# EAGLE design Spectacle_Servo_Control_Board (EAGLE 7.6.0)
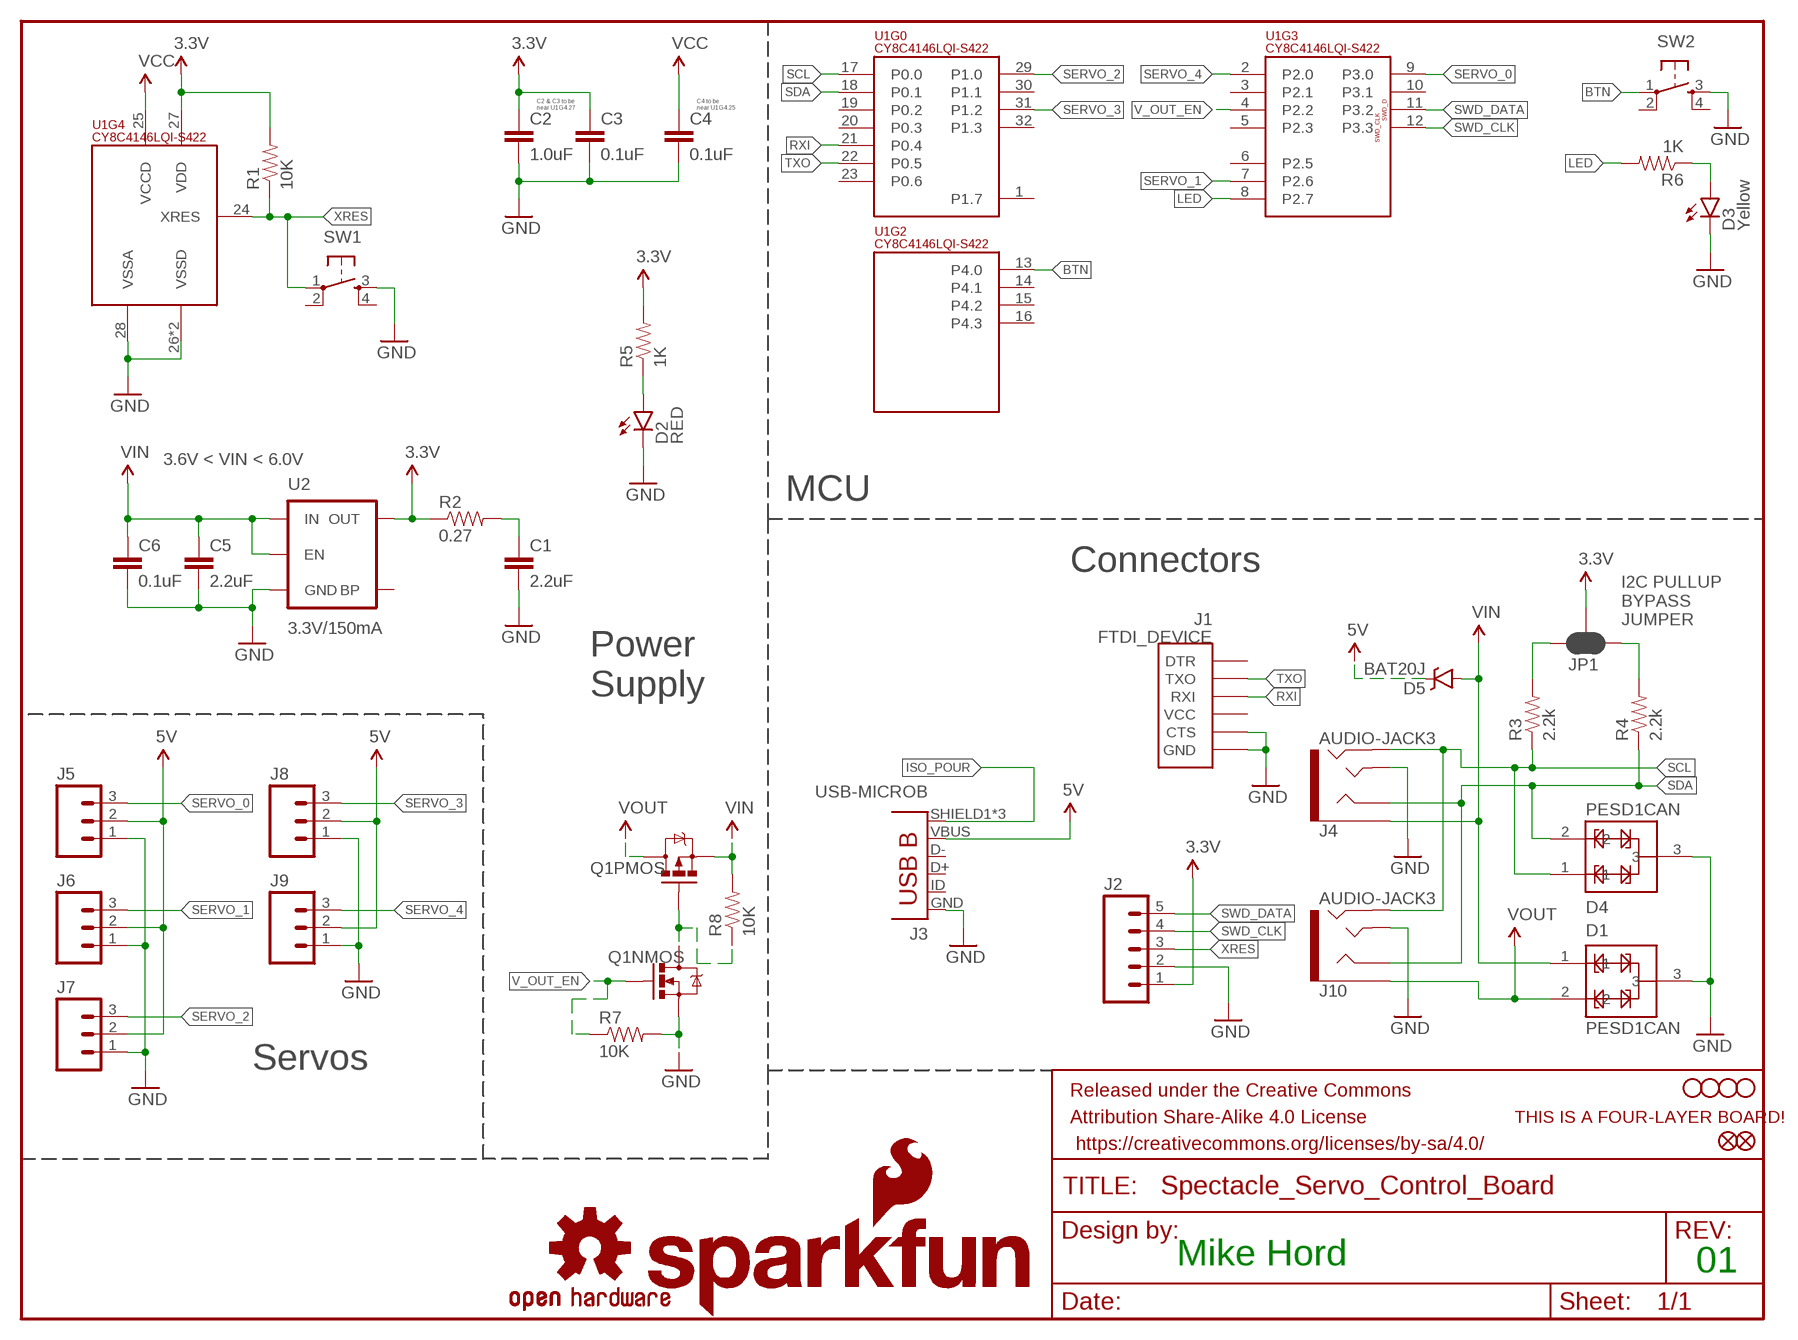
[diagram p0: schematic, sheet 1]

## Parts
C1  2.2uF  2.2UF-10V-20%(0603)  [0603-CAP]
C2  1.0uF  1.0UF-16V-10%(0402)  [0402-CAP]
C3  0.1uF  0.1UF-16V(+-10%)(0402)  [0402-CAP]
C4  0.1uF  0.1UF-16V(+-10%)(0402)  [0402-CAP]
C5  2.2uF  2.2UF-10V-20%(0603)  [0603-CAP]
C6  0.1uF  0.1UF-16V(+-10%)(0402)  [0402-CAP]
D1  PESD1CAN  [SOT23-3]
D2  RED  LED-RED0603  [LED-0603]
D3  Yellow  LED-YELLOW0603-SMART  [LED-0603]
D4  PESD1CAN  [SOT23-3]
D5  BAT20J  DIODE-SCHOTTKY-BAT20J  [SOD-323]
FD1  FIDUCIALUFIDUCIAL  [MICRO-FIDUCIAL]
FD2  FIDUCIALUFIDUCIAL  [MICRO-FIDUCIAL]
FRAME1  FRAME-LETTER  [CREATIVE_COMMONS]
H1  STAND-OFF  [STAND-OFF]
H2  STAND-OFF  [STAND-OFF]
H3  STAND-OFF  [STAND-OFF]
H4  STAND-OFF  [STAND-OFF]
J1  FTDI_DEVICE  [FTDI_DEVICE_SIDE]
J2  M05PTH  [1X05]
J3  USB-MICROB  USB-MICROB"  [USB-B-MICRO-SMD_V03]
J4  AUDIO-JACK3  [AUDIO-JACK-TRRS-SMD]
J5  M03LOCK  [1X03_LOCK]
J6  M03LOCK  [1X03_LOCK]
J7  M03LOCK  [1X03_LOCK]
J8  M03LOCK  [1X03_LOCK]
J9  M03LOCK  [1X03_LOCK]
J10  AUDIO-JACK3  [AUDIO-JACK-TRRS-SMD]
JP1  JUMPER-PAD-3-NC_BY_PASTE  [PAD-JUMPER-3-NC_BY_PASTE_YES_SILK_FULL_BOX]
LOGO1  OSHW-LOGOS  [OSHW-LOGO-S]
LOGO2  SFE_LOGO_NAME_FLAME.1_INCH  [SFE_LOGO_NAME_FLAME_.1]
LOGO3  SFE_LOGO_NAME_FLAME.1_INCH  [SFE_LOGO_NAME_FLAME_.1]
LOGO4  OSHW-LOGOS  [OSHW-LOGO-S]
Q1  IRF7509  [MSOP8]
R1  10K  10KOHM-1/10W-1%(0603)0603  [0603-RES]
R2  0.27  0.27OHM-1/10W-1%(0603)  [0603-RES]
R3  2.2k  2.2KOHM-1/10W-1%(0603)  [0603-RES]
R4  2.2k  2.2KOHM-1/10W-1%(0603)  [0603-RES]
R5  1K  1KOHM-1/10W-1%(0603)  [0603-RES]
R6  1K  1KOHM-1/10W-1%(0603)  [0603-RES]
R7  10K  10KOHM-1/10W-1%(0603)0603  [0603-RES]
R8  10K  10KOHM-1/10W-1%(0603)0603  [0603-RES]
SW1  SWITCH_SPST_4_PINRECT  [TACTILE_SWITCH_SMD_4.6X2.8MM]
SW2  SWITCH_SPST_4_PINRECT  [TACTILE_SWITCH_SMD_4.6X2.8MM]
U1  CY8C4146LQI-S422  PSOC4_4100S_32QFN  [QFN-32]
U2  3.3V/150mA  V_REG_MIC52053.3V  [SOT23-5]
U$1  FOUR_LAYER_WARNING  [FOUR_LAYER_WARNING]

## Nets
3.3V: C2.1 C3.1 J2.1 JP1.2 R1.2 R2.1 R5.2 U1.27(VDD) U2.5(OUT)
5V: D5.C J3.VBUS J5.2 J6.2 J7.2 J8.2 J9.2
BTN: SW2.1 U1.13(P4.0)
GND: C1.2 C2.2 C3.2 C4.2 C5.2 C6.2 D1.3 D2.C D3.C D4.3 J1.P$5(CTS) J1.P$6(GND) J2.2 J3.GND J4.TIP J5.1 J6.1 J7.1 J8.1 J9.1 J10.TIP Q1.1(NMOS:S) R7.2 SW1.3 SW2.3 U1.26(VSSD) U1.28(VSSA) U1.EP(VSSD) U2.2(GND)
ISO_POUR: J3.SHIELD1(SHIELD) J3.SHIELD2(SHIELD) J3.SHIELD3(SHIELD)
LED: R6.2 U1.8(P2.7)
N$2: JP1.3 R3.2
N$3: C1.1 R2.2
N$4: D2.A R5.1
N$5: D3.A R6.1
N$6: JP1.1 R4.2
N$26: Q1.4(PMOS:G) Q1.7(NMOS:D) Q1.8(NMOS:D) R8.1
RXI: J1.P$3(RXI) U1.21(P0.4)
SCL: D4.1 J4.RING2 J10.RING2 R3.1 U1.17(P0.0)
SDA: D4.2 J4.RING1 J10.RING1 R4.1 U1.18(P0.1)
SERVO_0: J5.3 U1.9(P3.0)
SERVO_1: J6.3 U1.7(P2.6)
SERVO_2: J7.3 U1.29(P1.0)
SERVO_3: J8.3 U1.31(P1.2)
SERVO_4: J9.3 U1.2(P2.0)
SWD_CLK: J2.4 U1.12(P3.3)
SWD_DATA: J2.5 U1.11(P3.2)
TXO: J1.P$2(TXO) U1.22(P0.5)
V_OUT_EN: Q1.2(NMOS:G) R7.1 U1.4(P2.2)
VCC: C4.1 U1.25(VCCD)
VIN: C5.1 C6.1 D1.1 D5.A J4.EARTH Q1.3(PMOS:S) R8.2 U2.1(IN) U2.3(EN)
VOUT: D1.2 J10.EARTH Q1.5(PMOS:D) Q1.6(PMOS:D)
XRES: J2.3 R1.1 SW1.1 U1.24(XRES)
Unconnected: J1.P$1(DTR) J1.P$4(VCC) J3.D+ J3.D- J3.ID(USBID) SW1.2 SW1.4 SW2.2 SW2.4 U1.1(P1.7) U1.3(P2.1) U1.5(P2.3) U1.6(P2.5) U1.10(P3.1) U1.14(P4.1) U1.15(P4.2) U1.16(P4.3) U1.19(P0.2) U1.20(P0.3) U1.23(P0.6) U1.30(P1.1) U1.32(P1.3) U2.4(BP)

## Notes on the sheet
- C2 & C3 to be
  near U1G4.27
- C4 to be
  near U1G4.25
- 3.6V < VIN < 6.0V
- MCU
- Connectors
- I2C PULLUP
  BYPASS
  JUMPER
- Power
  Supply
- Servos
- Mike Hord | 01

## Library data of the parts
C1 C5 = SparkFun-Capacitors:2.2UF-10V-20%(0603): CAP-07888; PROD_ID: CAP-07888
C2 = SparkFun-Capacitors:1.0UF-16V-10%(0402); PROD_ID: CAP-12417
C3 C4 C6 = SparkFun-Capacitors:0.1UF-16V(+-10%)(0402); PROD_ID: CAP-12416
D1 D4 = SparkFun-DiscreteSemi:PESD1CAN: PESD1CAN is used to protect two automotive CAN bus lines from ESD.; PROD_ID: DIO-12501
D2 = SparkFun-LED:LED-RED: Assorted Red LEDs LilyPad 1206- DIO-09912 1206- DIO-00809 0603- DIO-00819 "SMART" means more efficient and expensive; PROD_ID: DIO-00819
D3 = SparkFun-LED:LED-YELLOW: Yellow SMD LEDs LilyPad 1206- DIO-09909 0603- DIO-09003 "SMART" means more efficient and expensive; PROD_ID: DIO-11230
D5 = SparkFun-DiscreteSemi:DIODE-SCHOTTKY: Schottky diodes in SFE's production catalog BAT20J 1A 23V 0.62Vf RB751 120mA 40V 0.37Vf PMEG4005EJ 0.5A 40V 0.42Vf MBRA140 1A 40V 0.5Vf B340A 3A 40V SMA; PROD_ID: DIO-11623
FD1 FD2 = SparkFun-Aesthetics:FIDUCIAL: Fiducial Alignment Points Various fiducial points for machine vision alignment.
FRAME1 = SparkFun-Aesthetics:FRAME-LETTER: Schematic Frame Standard 8.5x11 US Letter frame
H1-H4 = SparkFun-Electromechanical:STAND-OFF: #4 Stand Off This is the mechanical footprint for a #4 phillips button head screw. Use the keepout ring to avoid running the screw head into surrounding components. SKU : PRT-00447
J1 = SparkFun-Connectors:FTDI_DEVICE: Connector which mates to FTDI basic or FTDI cable.
J2 = SparkFun-Connectors:M05: Header 5 Standard 5-pin 0.1" header. Use with straight break away headers (SKU : PRT-00116), right angle break away headers (PRT-00553), swiss pins (PRT-00743), machine pins (PRT-00117), and female headers (PRT-00115). Molex polarized connector foot print use with SKU : PRT-08230 with associated crimp pins and housings.
J3 = SparkFun-Connectors:USB-MICROB; PROD_ID: CONN-11752
J4 J10 = SparkFun-Connectors:AUDIO-JACK3: Audio jack - 3.5mm TRRS variety - two rings.; PROD_ID: CONN-10676
J5-J9 = SparkFun-Connectors:M03: Header 3 Standard 3-pin 0.1" header. Use with straight break away headers (SKU : PRT-00116), right angle break away headers (PRT-00553), swiss pins (PRT-00743), machine pins (PRT-00117), and female headers (PRT-00115). Molex polarized connector foot print use with SKU : PRT-08232 with associated crimp pins and housings.
JP1 = SparkFun-Passives:JUMPER-PAD-3-NC_BY_PASTE
LOGO1 LOGO4 = SparkFun-Aesthetics:OSHW-LOGO: Open Source Hardware Logo This logo indicates the piece of hardware it is found on incorporates a OSHW license and/or adheres to the definition of open source hardware found here: http://freedomdefined.org/OSHW
LOGO2 LOGO3 = SparkFun-Aesthetics:SFE_LOGO_NAME_FLAME: SFE Logo, name and flame This is the SparkFun full logo. The logo on the schematic will always be the same size; the package variant is the height of the flame part of the logo. Default layer for the logo on the board is tSilk.
Q1 = SparkFun-DiscreteSemi:IRF7509: 30V Dual PMOS/NMOS MSOP-8 NMOS RDS .11-ohm PMOS RDS .20-ohm TRANS-07913; PROD_ID: TRANS-07913
R1 R7 R8 = SparkFun-Resistors:10KOHM-1/10W-1%(0603): RES-00824; PROD_ID: RES-00824
R2 = SparkFun-Resistors:0.27OHM-1/10W-1%(0603): RES-08787; PROD_ID: RES-08787
R3 R4 = SparkFun-Resistors:2.2KOHM-1/10W-1%(0603): RES-08272; PROD_ID: RES-08272
R5 R6 = SparkFun-Resistors:1KOHM-1/10W-1%(0603): RES-07856; PROD_ID: RES-07856
SW1 SW2 = SparkFun-Electromechanical:SWITCH_SPST_4_PIN; PROD_ID: SWCH-13065
U1 = SparkFun-DigitalIC:PSOC4_4100S_32QFN; PROD_ID: IC-13286
U2 = SparkFun-PowerIC:V_REG_MIC5205: V_REG MIC5205 Standard 3.3V, 5V, and Adjustable 150mA LDO voltage regulator in SOT-23 layout. Micrel part MIC5205. BP (by-pass) pin is used to lower output noise with 470pF cap, may be left open. On the adjustable version BP is used to set output.; PROD_ID: VREG-00822
U$1 = SparkFun-Aesthetics:FOUR_LAYER_WARNING: Warning text which will appear on both the schematic and the board file, notifying viewers that the design is a four-layer PCB.

## Board
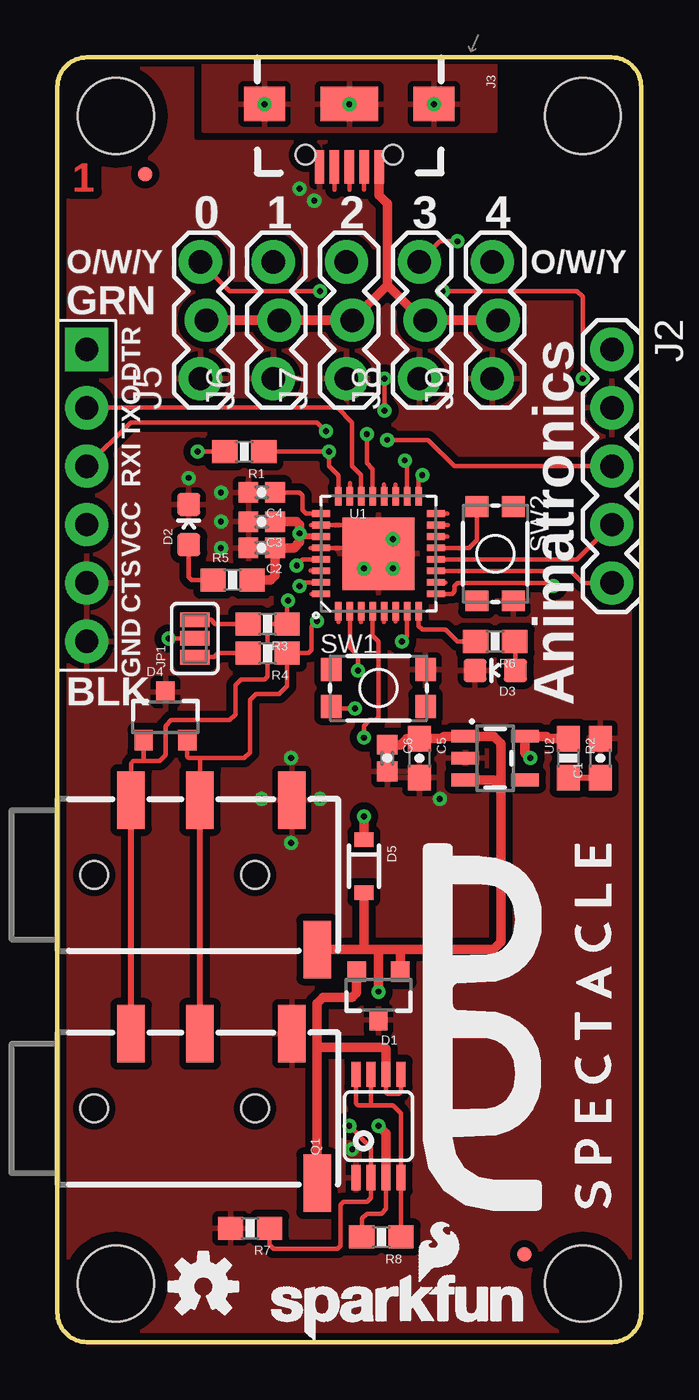
[diagram p1: board, top side]
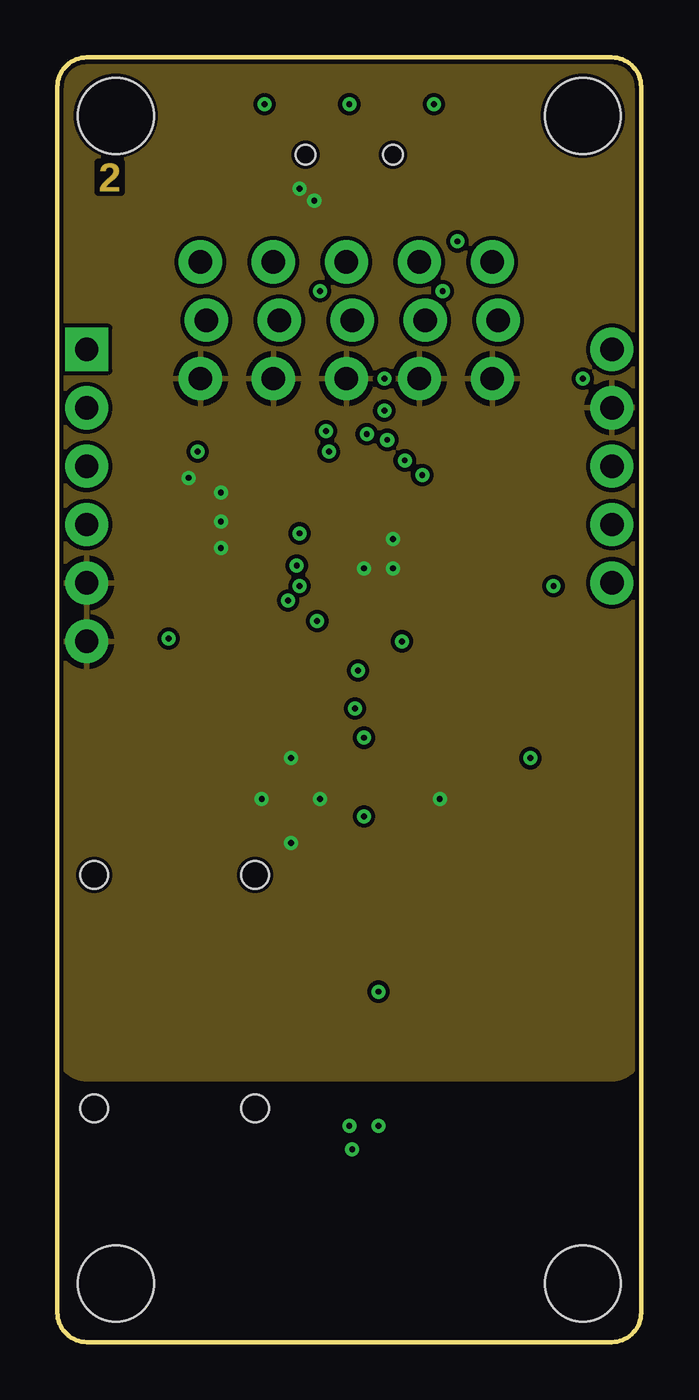
[diagram p2: board, inner layer Route2]
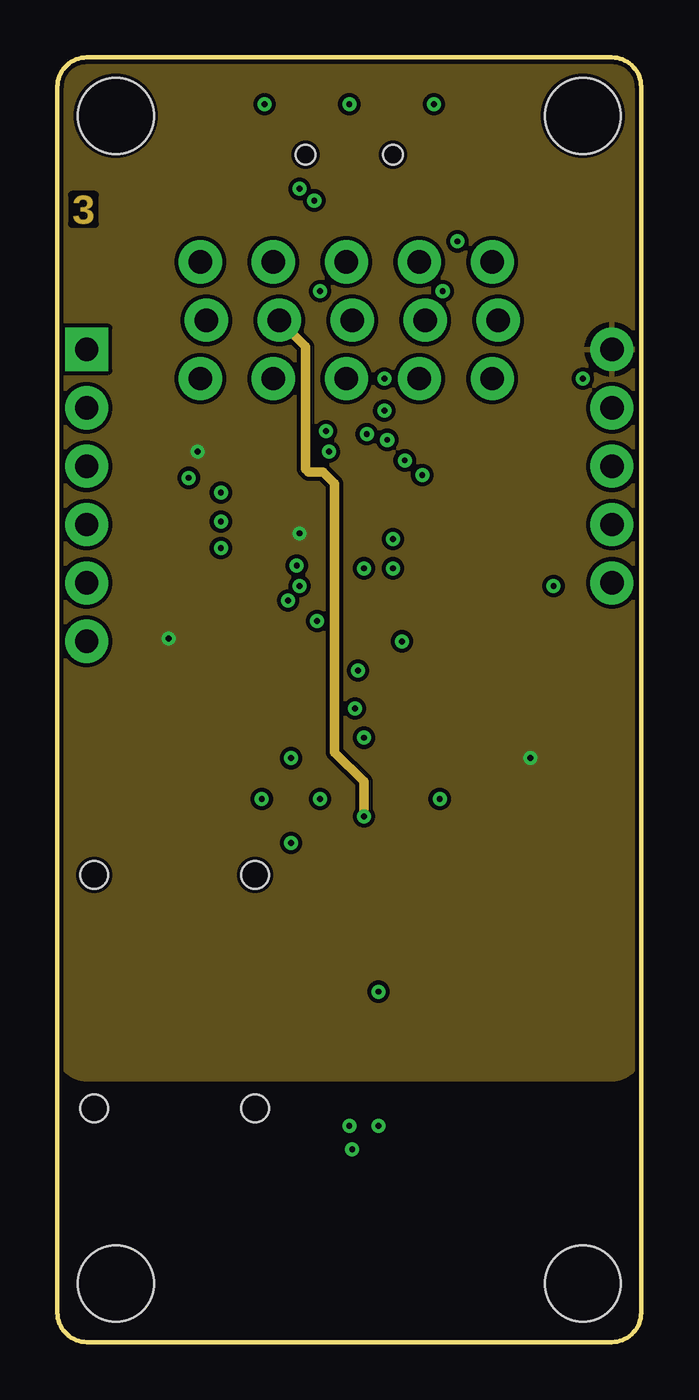
[diagram p3: board, inner layer Route15]
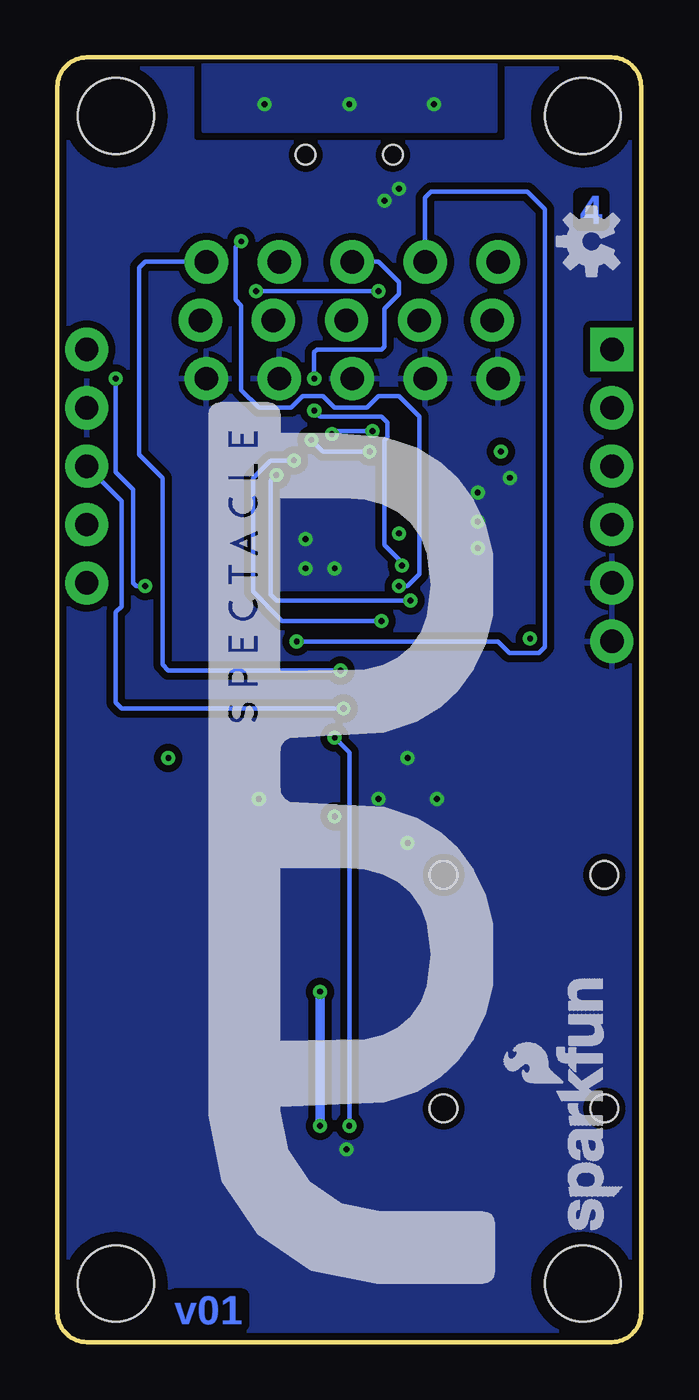
[diagram p4: board, bottom side, seen from below]

Size 25.4 x 55.88 mm. Coordinates in mm from the lower left corner, seen from the top.
Outline: 24.13,0 1.27,0 arc-90 0,1.27 0,54.61 arc-90 1.27,55.88 24.13,55.88 arc-90 25.4,54.61 25.4,1.27 arc-90 24.13,0
Copper layers (1*2*15*16): Top 0.035559375mm / dielectric 0.47751875mm / Route2 0.035559375mm / dielectric 0.47751875mm / Route15 0.035559375mm / dielectric 0.47751875mm / Bottom 0.035559375mm
Design rules "SparkFun-4-layer-TIGHT *": minimum track width 7mil, minimum drill 10mil, track to track 7mil, track to pad 7mil, pad to pad 7mil, via to via 7mil, smd to smd 7mil, copper to edge 7mil, drill to drill 7mil, minimum pad ring 7mil, minimum via ring 7mil, stop-mask expansion 4mil, vias tented up to drill 25mil, thermal gap 10mil

### Footprints (pad centres in the part's own frame; a part is rotated, then mirrored left to right if it is on the bottom)
0603-CAP = smd 1.1 x 1: 1 -0.85,0; 2 0.85,0
0402-CAP = smd 0.85 x 0.9: 1 -0.58,0; 2 0.58,0
SOT23-3 = smd 0.8 x 0.9: 1 -0.95,-1; 2 0.95,-1; 3 0,1.1
LED-0603 = smd 1 x 1: A 0,-0.877; C 0,0.877
SOD-323 = smd 0.63 x 0.83: A 1.15,0; C -1.15,0
MICRO-FIDUCIAL = smd 0.635 x 0.635: 1 0,0
STAND-OFF = hole 3.302: 0,0
FTDI_DEVICE_SIDE = drill 1.016 pad 1.88 square: P$1 -6.35,0 | drill 1.016 pad 1.88: P$2 -3.81,0; P$3 -1.27,0; P$4 1.27,0; P$5 3.81,0; P$6 6.35,0
1X05 = drill 1.016 pad 1.88: 1 0,0; 2 2.54,0; 3 5.08,0; 4 7.62,0; 5 10.16,0
USB-B-MICRO-SMD_V03 = smd 1.45 x 0.4: D+ 2.725,0; D- 2.725,0.65; GND 2.725,-1.3; ID 2.725,-0.65; VBUS 2.725,1.3 | smd 1.5 x 1.8: SHIELD1 0,3.685; SHIELD2 0,-3.685 | smd 1.5 x 2.5: SHIELD3 0,0 | hole 0.85: 2.2,1.9; 2.2,-1.9
AUDIO-JACK-TRRS-SMD = smd 1.2 x 2.5: EARTH 11.3,-3.25; RING1 6.2,3.25; RING2 3.2,3.25; TIP 10.2,3.25 | hole 1.2: 1.6,0; 8.6,0
1X03_LOCK = drill 1.016 pad 1.88: 1 0,0.127; 2 2.54,-0.127; 3 5.08,0.127
PAD-JUMPER-3-NC_BY_PASTE_YES_SILK_FULL_BOX = smd 0.635 x 1.27: 1 -0.813,0; 2 0,0; 3 0.813,0
MSOP8 = smd 0.4 x 1.1: 1 -0.975,-2.25; 2 -0.325,-2.25; 3 0.325,-2.25; 4 0.975,-2.25; 5 0.975,2.25; 6 0.325,2.25; 7 -0.325,2.25; 8 -0.975,2.25
0603-RES = smd 1.1 x 1: 1 -0.85,0; 2 0.85,0
TACTILE_SWITCH_SMD_4.6X2.8MM = smd 0.9 x 1: 1 -2.05,-0.8; 2 2.05,-0.8; 3 2.05,0.8; 4 -2.05,0.8
QFN-32 = smd 0.285 x 0.8: 1 -1.75,-2.5; 2 -1.25,-2.5; 3 -0.75,-2.5; 4 -0.25,-2.5; 5 0.25,-2.5; 6 0.75,-2.5; 7 1.25,-2.5; 8 1.75,-2.5; 17 1.75,2.5; 18 1.25,2.5; 19 0.75,2.5; 20 0.25,2.5; 21 -0.25,2.5; 22 -0.75,2.5; 23 -1.25,2.5; 24 -1.75,2.5 | smd 0.8 x 0.285: 9 2.5,-1.75; 10 2.5,-1.25; 11 2.5,-0.75; 12 2.5,-0.25; 13 2.5,0.25; 14 2.5,0.75; 15 2.5,1.25; 16 2.5,1.75; 25 -2.5,1.75; 26 -2.5,1.25; 27 -2.5,0.75; 28 -2.5,0.25; 29 -2.5,-0.25; 30 -2.5,-0.75; 31 -2.5,-1.25; 32 -2.5,-1.75 | smd 3.15 x 3.15: EP 0,0
SOT23-5 = smd 0.55 x 1.2: 1 -0.95,-1.3; 2 0,-1.3; 3 0.95,-1.3; 4 0.95,1.3; 5 -0.95,1.3

### Placement (x,y rotation side)
C1  23.62,25.4 90 top
C2  8.89,34.54 180 top
C3  8.89,35.69 180 top
C4  8.89,36.96 180 top
C5  15.75,25.4 270 top
C6  14.35,25.4 270 top
D1  13.97,15.11 180 top
D2  5.71,35.56 0 top
D3  19.05,29.21 90 top
D4  4.7,27.18 0 top
D5  13.34,20.7 270 top
FD1  20.32,3.81 0 top
FD2  3.81,50.8 0 top
FRAME1  59.69,45.72 0 top  (outside the outline)
H1  22.86,53.34 0 top
H2  2.54,53.34 0 top
H3  22.86,2.54 0 top
H4  2.54,2.54 0 top
J1  1.27,36.83 270 top
J2  24.13,43.18 270 top
J3  12.7,53.85 270 top
J4  0,20.32 0 top
J5  6.35,41.91 90 top
J6  9.53,41.91 90 top
J7  12.7,41.91 90 top
J8  15.88,41.91 90 top
J9  19.05,41.91 90 top
J10  0,10.16 0 top
JP1  5.98,30.61 90 top
LOGO1  6.35,2.41 0 top
LOGO2  8.89,0 0 top
LOGO3  0.76,4.45 90 bottom
LOGO4  2.16,47.88 90 bottom
Q1  13.97,9.4 0 top
R1  8.13,38.73 180 top
R2  22.23,25.4 270 top
R3  9.14,31.24 180 top
R4  9.14,29.97 180 top
R5  7.62,33.15 0 top
R6  19.05,30.48 180 top
R7  8.38,4.95 180 top
R8  14.1,4.57 180 top
SW1  13.97,28.45 0 top
SW2  19.05,34.29 270 top
U1  13.97,34.29 0 top
U2  19.05,25.4 270 top
U$1  39.37,54.61 0 top  (outside the outline)
U$2  [SPECTACLE_LOGO_TITLE_0.35X0.70]  24.13,5.71 90 top
U$3  [SPECTACLE_LOGO_NEGATIVE_1.5X0.5]  6.35,2.54 90 bottom

### Tracks (layer width: path | path; a pad name or v marks a point on that pad's centre or on a via)
3.3V  (via drill 0.25)
  Top 0.203: 10.55,35.04 10.54,35.05 | JP1.2 v4.83,30.61 | R1.2 v6.1,38.73
  Top 0.254: U1.27 10.55,35.04
  Top 0.406: R2.1 21.38,26.25 21.27,26.35 U2.5 20.35,25.62 v20.57,25.4 | C3.1 10.41,35.69 10.54,35.56 v10.54,35.18 10.54,35.05 10.54,34.8 10.29,34.54 C2.1 9.47,33.35 9.27,33.15 R5.2
  pour Route15: 24.13,11.43 1.27,11.43 arc-90 0,12.7 0,54.61 arc-90 1.27,55.88 24.13,55.88 arc-90 25.4,54.61 25.4,12.7 arc-90
5V  (via drill 0.25)
  Top 0.406: 14.35,45.97 14.35,49.53 14,49.88 J3.VBUS | J9.2 J8.2 15.88,44.45 14.35,45.97 | J5.2 J6.2 J7.2 14.35,45.97 | D5.C v13.34,22.86
  Route15 0.406: v13.34,22.86 13.34,24.38 12.06,25.65 12.06,37.34 11.56,37.85 10.92,37.85 10.79,37.97 10.79,43.31 J6.2
BTN
  Top 0.203: SW2.1 18.25,34.89 17.9,34.54 U1.13
GND  (via drill 0.25)
  Top 0.203: U1.26 12.72,35.54 U1.EP | U1.28 13.72,34.54 U1.EP | v14.61,34.92 U1.EP
  other vias: 14.61,33.66 13.34,33.66 10.54,50.16 11.18,49.66 16.64,23.62 11.43,23.62 10.16,25.4 8.89,23.62 10.16,21.72 5.71,37.59 7.11,35.69 7.11,34.54 7.11,36.96 12.83,8.38
  pour Bottom (isolate 0.305, rank 2): 0,1.27 0,54.61 arc-90 1.27,55.88 24.13,55.88 arc-90 25.4,54.61 25.4,1.27 arc-90 24.13,0 1.27,0 arc-90
  pour Top (isolate 0.305, rank 2): 0,1.27 0,54.61 arc-90 1.27,55.88 24.13,55.88 arc-90 25.4,54.61 25.4,1.27 arc-90 24.13,0 1.27,0 arc-90
  pour Route2: 24.13,11.43 1.27,11.43 arc-90 0,12.7 0,54.61 arc-90 1.27,55.88 24.13,55.88 arc-90 25.4,54.61 25.4,12.7 arc-90
ISO_POUR  (via drill 0.25)
  other vias: 12.7,53.85 9.02,53.85 16.38,53.85
  pour Top: 6.35,55.88 6.35,52.7 19.05,52.7 19.05,55.88
  pour Bottom: 6.35,55.88 6.35,52.7 19.05,52.7 19.05,55.88
LED
  Top 0.203: U1.8 15.72,31.14 15.88,30.99 16.89,30.99 17.4,30.48 R6.2
N$1
  Top 0.203: 12.05,50.85 12.05,50.13
N$2
  Top 0.203: JP1.3 6.69,31.42 6.87,31.24 R3.2
N$3
  Top 0.254: R2.2 C1.1
N$4
  Top 0.203: R5.1 5.84,33.15 5.71,33.27 D2.A
N$5
  Top 0.203: D3.A 19.93,30.45 R6.1
N$6
  Top 0.203: JP1.1 6.82,29.79 6.99,29.97 R4.2
N$7
  Top 0.203: 12.7,50.73 12.7,50.13
N$8
  Top 0.203: 13.35,50.71 13.35,50.13
N$9
  Top 0.203: 12.72,36.94 12.72,37.37
N$10
  Top 0.203: 14.22,36.93 14.22,37.31
N$11
  Top 0.203: 14.72,36.8 14.72,37.3
N$12
  Top 0.203: 16.47,36.04 16.97,36.04
N$13
  Top 0.203: 16.5,35.55 17,35.55
N$14
  Top 0.203: 16.48,35.04 16.98,35.04
N$15
  Top 0.203: 16.39,33.04 16.89,33.04
N$16
  Top 0.203: 14.72,31.84 14.72,31.34
N$17
  Top 0.203: 14.22,31.83 14.22,31.33
N$19
  Top 0.203: 13.22,31.83 13.22,31.33
N$20
  Top 0.203: 12.22,31.82 12.22,31.32
N$21
  Top 0.203: 11.56,32.54 11.06,32.54
N$22
  Top 0.203: 11.52,33.55 11.02,33.55
N$23
  Top 0.203: 11.52,34.54 11.02,34.54
N$24
  Top 0.203: 11.54,35.54 11.04,35.54
N$26
  Top 0.203: R8.1 Q1.4 14.95,9.95 14.61,10.29 13.59,10.29 | Q1.8 12.99,10.37 13.08,10.29 13.59,10.29 | Q1.7 13.64,10.34 13.59,10.29
RXI  (via drill 0.25)
  Top 0.203: U1.21 13.72,37.97 13.46,38.23 v13.46,39.5 | J1.P$3 3.17,40.01 11.3,40.01 v11.68,39.62
  Bottom 0.203: v11.68,39.62 13.34,39.62 v13.46,39.5
SCL  (via drill 0.25)
  Top 0.203: v10.03,32.26 9.99,32.22 R3.1 9.27,31.24 9.14,31.11 9.14,28.96 9.02,28.83 8,28.83 7.75,28.57 7.75,27.3 7.49,27.05 4.95,27.05 4.7,26.8 4.7,25.53 4.45,25.27 3.81,25.27 | v15.88,37.72 15.72,37.56 U1.17 | J4.RING2 3.2,25.17 3.3,25.27 3.81,25.27 | D4.1 3.75,25.33 3.81,25.27
  Top 0.254: J10.RING2 J4.RING2
  Bottom 0.203: v10.03,32.26 15.88,32.26 16.13,32.51 16.13,37.47 v15.88,37.72
SDA  (via drill 0.25)
  Top 0.203: v11.3,31.37 11.05,31.11 11.05,30.1 10.92,29.97 R4.1 9.99,28.54 9.65,28.19 8.64,28.19 8.38,27.94 8.38,25.65 8.13,25.4 6.22,25.4 | v15.11,38.35 15.22,38.25 U1.18 | D4.2 5.65,25.47 5.71,25.4 6.22,25.4 | J4.RING1 6.2,25.38 6.22,25.4
  Top 0.254: J10.RING1 6.2,22.71 6.35,22.86 6.35,23.42 J4.RING1
  Bottom 0.203: v11.3,31.37 15.62,31.37 16.89,32.64 16.89,37.59 16.13,38.35 v15.11,38.35
SERVO_0  (via drill 0.25)
  Top 0.203: U1.9 17.17,32.54 17.27,32.64 17.27,32.89 17.4,33.02 21.46,33.02 v21.59,32.89 | v22.86,41.91 22.86,45.47 22.61,45.72 v16.76,45.72 | v11.43,45.72 7.49,45.72 J5.3
  Bottom 0.203: v21.59,32.89 21.97,32.89 22.1,33.02 22.1,37.08 22.86,37.85 v22.86,41.91 | v16.76,45.72 v11.43,45.72
SERVO_1  (via drill 0.25)
  Top 0.203: U1.7 15.22,30.71 v14.99,30.48
  Bottom 0.203: v14.99,30.48 6.23,30.48 5.72,29.97 4.45,29.97 4.19,30.23 4.19,49.28 4.95,50.04 9.14,50.04 9.4,49.78 J6.3
SERVO_2  (via drill 0.25)
  Top 0.203: U1.29 10.67,34.04 v10.41,33.78 | v14.22,40.51 v14.22,41.91
  Bottom 0.203: v10.41,33.78 10.41,33.91 11.18,34.67 11.18,39.24 11.05,39.37 11.05,40.01 11.3,40.26 13.97,40.26 v14.22,40.51 14.1,40.64 | v14.22,41.91 14.22,43.05 14.1,43.18 11.3,43.18 11.18,43.31 11.18,44.96 10.54,45.59 10.54,46.1 11.43,46.99 J7.3
SERVO_3  (via drill 0.25)
  Top 0.203: U1.31 10.69,33.04 v10.54,32.89 | v17.4,47.88 16.64,47.88 J8.3
  Bottom 0.203: v17.4,47.88 17.65,47.62 17.65,45.34 17.4,45.09 17.4,41.4 16.64,40.64 15.24,40.64 14.73,41.15 13.84,41.15 13.34,40.64 11.94,40.64 11.43,41.15 10.54,41.15 9.65,40.26 9.65,33.4 10.16,32.89 v10.54,32.89
SERVO_4  (via drill 0.25)
  Top 0.203: U1.2 12.72,30.21 13.08,29.84 v13.08,29.21
  Bottom 0.203: v13.08,29.21 20.57,29.21 20.83,29.46 20.83,37.59 21.84,38.61 21.84,46.74 21.59,46.99 J9.3
SWD_CLK
  Top 0.203: U1.12 22.61,34.04 J2.4
SWD_DATA
  Top 0.203: U1.11 22.34,33.54 22.86,33.02 J2.5
TXO
  Top 0.203: J1.P$2 12.19,40.64 12.83,40.01 12.83,38.1 13.21,37.72 13.21,36.8 U1.22
V_OUT_EN  (via drill 0.25)
  Top 0.203: R7.1 9.23,4.23 9.4,4.06 12.19,4.06 12.32,4.19 12.32,5.97 12.45,6.1 13.46,6.1 13.64,6.28 Q1.2 13.64,8.45 v12.7,9.4 | v13.34,26.29 13.34,26.8 13.59,27.05 13.84,27.05 13.97,27.18 13.97,30.48 13.72,30.73 U1.4
  Bottom 0.203: v12.7,9.4 12.7,25.65 v13.34,26.29
VCC
  Top 0.203: U1.25 10.82,36.04 10.67,36.2 10.67,36.83 10.54,36.96 C4.1
VIN  (via drill 0.25)
  Top 0.203: Q1.3 14.29,5.79 14.1,5.59 13.46,5.59 13.25,5.37 R8.2
  Top 0.406: C6.1 14.93,25.98 15.2,26.25 C5.1 16.73,26.25 16.82,26.35 U2.1 18.99,26.35 19.3,26.04 19.3,24.13 | 17.78,24.42 U2.3 18.98,24.45 19.3,24.13 | J4.EARTH 13.34,17.07 | 13.34,17.07 13.97,17.07 | 13.97,17.07 14.99,17.07 | 14.99,17.07 18.98,17.07 19.3,17.4 19.3,24.13 | D5.A 13.34,17.07 | Q1.3 14.29,9.07 v13.97,9.4 | D1.1 14.92,17 14.99,17.07 | v13.97,15.24 13.97,17.07
  Bottom 0.406: v13.97,9.4 v13.97,15.24
VOUT
  Top 0.203: Q1.6 14.29,10.85 14.35,10.79 14.86,10.79 14.95,10.88 Q1.5
  Top 0.406: D1.2 13.02,15.18 12.83,14.99 11.56,14.99 11.3,14.73 11.3,12.7 | 11.3,12.7 11.3,6.48 11.43,6.35 11.43,6.78 J10.EARTH | Q1.6 14.29,12.76 14.22,12.83 11.43,12.83 11.3,12.7
XRES  (via drill 0.25)
  Top 0.203: J2.3 17.27,38.1 16.13,39.24 v14.35,39.24 | R1.1 v11.81,38.73 11.81,38.1 12.22,37.69 U1.24 | v12.95,27.56 12.01,27.56 SW1.1
  Bottom 0.203: J2.3 22.61,36.58 22.61,32 22.86,31.75 22.86,27.81 22.61,27.56 v12.95,27.56 | v11.81,38.73 13.84,38.73 v14.35,39.24

### Text on the board
Top: 1
Route2: 2
Route15: 3
Bottom: 4 | v01
tPlace: 0 | 1 | 2 | 3 | 4 | O/W/Y | O/W/Y | Animatronics
Measures: (typ.) | (typ.) | Dimensions in inches
tDocu: Mike Hord